# EasyEDA schematic TerraceLights.json
TITLE: Terrace Lights Boards Integrator; REV: 1.0; Date: 2019-01-25; Sheet: 1/1; Drawn By: ivan.aragones.muniesa; Company: Your Company
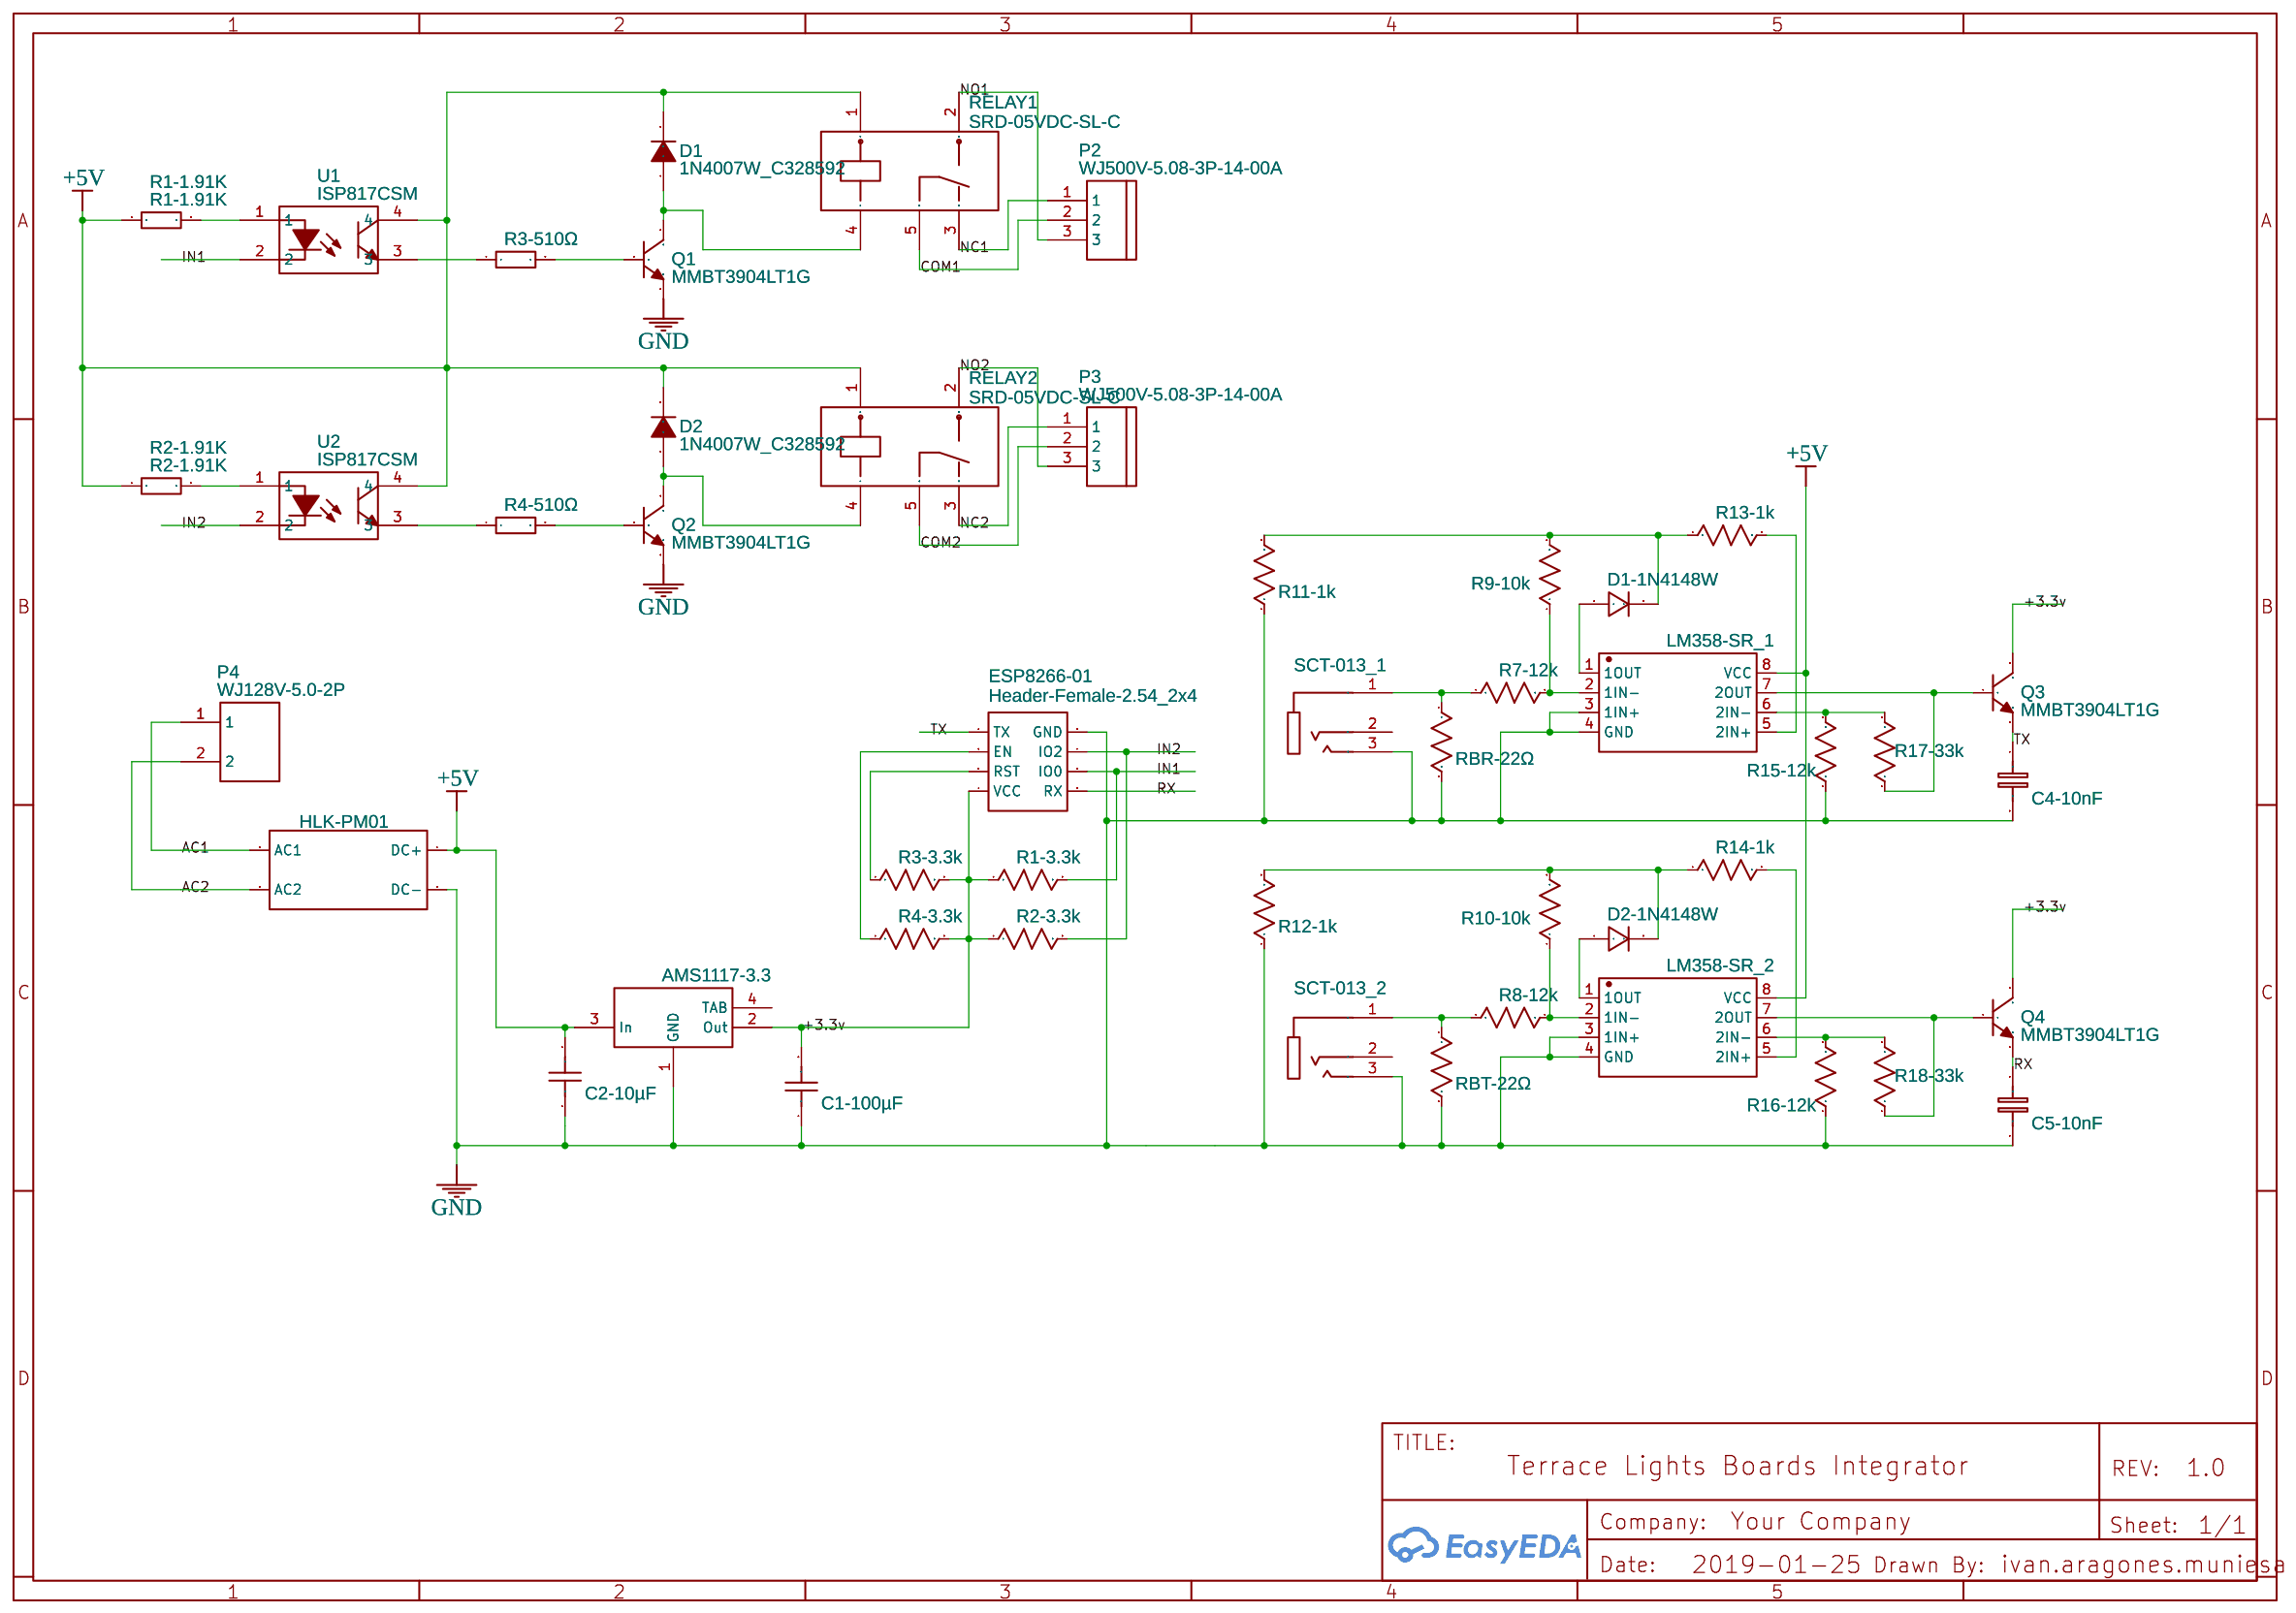
[diagram p0: schematic sheet]

## Parts
ASM1117-3  AMS1117-3.3  [SOT-223]  (section 3)
C1-100F  C1-100µF  [1206]
C2-10F  C2-10µF  [1206]
C4-10NF  C4-10nF  [1206]
C5-10NF  C5-10nF  [1206]
D1  1N4007W_C328592  [SOD-123FL]
D1-1N4148W  D1-1N4148W  [SOD-123]
D2  1N4007W_C328592  [SOD-123FL]
D2-1N4148W  D2-1N4148W  [SOD-123]
ESP8266-01  Header-Female-2.54_2x4  [DIP-2X4P-2.54]
HLK-PM01  HLK-PM01  [HLK-PM01]
LM358-SR_1  LM358-SR_1  [SOIC-8_150MIL]
LM358-SR_2  LM358-SR_2  [SOIC-8_150MIL]
P2  WJ500V-5.08-3P-14-00A  [WJ500V-5.08-3P]
P3  WJ500V-5.08-3P-14-00A  [WJ500V-5.08-3P]
P4  WJ128V-5.0-2P  [WJ128V-2P-5.0]
Q1  MMBT3904LT1G  [SOT-23(SOT-23-3)]
Q2  MMBT3904LT1G  [SOT-23(SOT-23-3)]
Q3  MMBT3904LT1G  [SOT-23(SOT-23-3)]
Q4  MMBT3904LT1G  [SOT-23(SOT-23-3)]
R1-1.91K  R1-1.91K  [0805]
R1-3.3K  R1-3.3k  [1206]
R2-1.91K  R2-1.91K  [0805]
R2-3.3K  R2-3.3k  [1206]
R3-3.3K  R3-3.3k  [1206]
R3-510  R3-510Ω  [0805]
R4-3.3K  R4-3.3k  [1206]
R4-510  R4-510Ω  [0805]
R7-12K  R7-12k  [1206]
R8-12K  R8-12k  [1206]
R9-10K  R9-10k  [1206]
R10-10K  R10-10k  [1206]
R11-1K  R11-1k  [1206]
R12-1K  R12-1k  [1206]
R13-1K  R13-1k  [1206]
R14-1K  R14-1k  [1206]
R15-12K  R15-12k  [1206]
R16-12K  R16-12k  [1206]
R17-33K  R17-33k  [1206]
R18-33K  R18-33k  [1206]
RBR-22  RBR-22Ω  [1206]
RBT-22  RBT-22Ω  [1206]
RELAY1  SRD-05VDC-SL-C  [RELAY-SL-SRD]
RELAY2  SRD-05VDC-SL-C  [RELAY-SL-SRD]
SCT-013_1  SCT-013_1  [PJ-320B]
SCT-013_2  SCT-013_2  [PJ-320B]
U1  ISP817CSM  [SMD-4]
U2  ISP817CSM  [SMD-4]

## Library data of the parts
ASM1117-3 = -: sourceId: dwIGgezVh; Supplier Part: C6186; Supplier: LCSC; Manufacturer: AMS; LCSC Assembly: Yes; image: https://assets.lcsc.com/images/szlcsc/900x900/C165482_front.jpg
C1-100F = Cap_1206_US: Manufacturer Part: JMK316ABJ107ML-T; Supplier: LCSC; Supplier Part: C268006; Manufacturer: Taiyo Yuden
C2-10F = Cap_1206_US: Manufacturer Part: JMK316BJ106KL-T; Supplier: LCSC; Supplier Part: C92789; Manufacturer: Taiyo Yuden
C4-10NF C5-10NF = Cap_RAD-0.1_EU: Manufacturer Part: 1206B103K101; Supplier: LCSC; Supplier Part: C77497; Manufacturer: WTC
D1 D2 = -: Supplier: LCSC; Supplier Part: C328592; Manufacturer: BLUE ROCKET; Manufacturer Part: 1N4007W; Contributor: LCSC
D1-1N4148W D2-1N4148W = -: Supplier Part: C81598; Supplier: LCSC; Manufacturer: SEMTECH; Manufacturer Part: 1N4148W; image: //image.lceda.cn/szlcsc/C81598.jpg
ESP8266-01 = -: Supplier Part: C124422; Supplier: LCSC; Manufacturer: Ckmtw; Manufacturer Part: 220S-2*4P H=8.5MM Ytype Gold-plated
HLK-PM01 = -: sourceId: u1BzxTRca; Manufacturer Part: ?; Mounted: No
LM358-SR_1 LM358-SR_2 = -: Supplier Part: C93149; Supplier: LCSC; Manufacturer: 3PEAK; Manufacturer Part: LM358-SR
P2 P3 = -: Supplier: LCSC; Manufacturer: ReliaPro; image: //image.lceda.cn/szlcsc/C72334.jpg; Supplier Part: C72334
P4 = -: Supplier: LCSC; Manufacturer: ReliaPro; Supplier Part: C8269
Q1-Q4 = -: Supplier: LCSC; Manufacturer: ON; Supplier Part: C81464
R1-1.91K R2-1.91K = ARG05FTC1911: Supplier: LCSC; Supplier Part: C218406; Manufacturer: Viking Tech; Contributor: LCSC
R1-3.3K R2-3.3K = Res_AXIAL-0.3(1/8W)_US: Manufacturer Part: TC0625B3301T5E; Supplier: LCSC; Manufacturer: Uniroyal Elec; Supplier Part: C95524
R3-3.3K R4-3.3K = Res_AXIAL-0.3(1/8W)_US: Manufacturer Part: TC0625B3301T5E; Supplier: LCSC; Supplier Part: C95524; Manufacturer: Uniroyal Elec
R3-510 R4-510 = PTFR0805B510RN9: Supplier: LCSC; Supplier Part: C328445; Manufacturer: ResistorToday; Contributor: LCSC
R7-12K R8-12K R15-12K R16-12K = Res_1206(1/4W)_US: Manufacturer Part: AR06DTDV1202; Supplier: LCSC; Supplier Part: C319895; Manufacturer: Viking Tech
R9-10K R10-10K = Res_1206(1/4W)_US: Manufacturer Part: B57621C5103K062; Supplier: LCSC; Supplier Part: C117697; Manufacturer: TDK
R11-1K R12-1K R13-1K R14-1K = Res_1206(1/4W)_US: Manufacturer Part: AR06BTDV1001; Supplier: LCSC; Supplier Part: C319818; Manufacturer: Viking Tech
R17-33K R18-33K = Res_1206(1/4W)_US: Manufacturer Part: ARG06DTC3302; Supplier: LCSC; Supplier Part: C311978; Manufacturer: Viking Tech
RBR-22 RBT-22 = Res_1206(1/4W)_US: Manufacturer Part: ARG06FTC0220; Supplier: LCSC; Supplier Part: C294137; Manufacturer: Viking Tech
RELAY1 RELAY2 = -: Supplier: LCSC; Manufacturer: SONGLE; image: //image.lceda.cn/szlcsc/C35449.jpg; Supplier Part: C35449
SCT-013_1 SCT-013_2 = -: Supplier: LCSC; Manufacturer: BOOMELE; Contributor: LCSC; Supplier Part: C18594
U1 U2 = -: Supplier: LCSC; Supplier Part: C84337; Manufacturer: Isocom Components; Contributor: LCSC

## Nets
+3.3v: ASM1117-3.2(Out) C1-100F.2 ESP8266-01.7(VCC) Q3.3 Q4.3 R1-3.3K.1 R2-3.3K.1 R3-3.3K.2 R4-3.3K.2
+5V: ASM1117-3.3(In) C2-10F.2 D1.2 D2.2 HLK-PM01.4(DC+) LM358-SR_1.8(VCC) LM358-SR_2.8(VCC) R1-1.91K.1 R2-1.91K.1 RELAY1.1 RELAY2.1 U1.4 U2.4
GND: ASM1117-3.1(GND) C1-100F.1 C2-10F.1 C4-10NF.2 C5-10NF.2 ESP8266-01.2(GND) HLK-PM01.3(DC-) LM358-SR_1.3(1IN+) LM358-SR_1.4(GND) LM358-SR_2.3(1IN+) LM358-SR_2.4(GND) Q1.2 Q2.2 R11-1K.1 R12-1K.1 R15-12K.1 R16-12K.1 RBR-22.2 RBT-22.2 SCT-013_1.3 SCT-013_2.3
AC1: HLK-PM01.1(AC1) P4.1
AC2: HLK-PM01.2(AC2) P4.2
COM1: P2.2 RELAY1.5
COM2: P3.2 RELAY2.5
IN1: ESP8266-01.6(IO0) R1-3.3K.2 U1.2
IN2: ESP8266-01.4(IO2) R2-3.3K.2 U2.2
NC1: P2.1 RELAY1.3
NC2: P3.1 RELAY2.3
NO1: P2.3 RELAY1.2
NO2: P3.3 RELAY2.2
RX: C5-10NF.1 ESP8266-01.8(RX) Q4.2
TX: C4-10NF.1 ESP8266-01.1(TX) Q3.2
Net-(D1-1): D1.1 Q1.3 RELAY1.4
Net-(D1-1N4148W-1): D1-1N4148W.1(A) LM358-SR_1.1(1OUT)
Net-(D1-1N4148W-2): D1-1N4148W.2(K) R9-10K.2 R11-1K.2 R13-1K.1
Net-(D2-1): D2.1 Q2.3 RELAY2.4
Net-(D2-1N4148W-1): D2-1N4148W.1(A) LM358-SR_2.1(1OUT)
Net-(D2-1N4148W-2): D2-1N4148W.2(K) R10-10K.2 R12-1K.2 R14-1K.1
Net-(ESP8266-01-3): ESP8266-01.3(EN) R4-3.3K.1
Net-(ESP8266-01-5): ESP8266-01.5(RST) R3-3.3K.1
Net-(LM358-SR_1-2): LM358-SR_1.2(1IN-) R7-12K.2 R9-10K.1
Net-(LM358-SR_1-5): LM358-SR_1.5(2IN+) R13-1K.2
Net-(LM358-SR_1-6): LM358-SR_1.6(2IN-) R15-12K.2 R17-33K.2
Net-(LM358-SR_1-7): LM358-SR_1.7(2OUT) Q3.1 R17-33K.1
Net-(LM358-SR_2-2): LM358-SR_2.2(1IN-) R8-12K.2 R10-10K.1
Net-(LM358-SR_2-5): LM358-SR_2.5(2IN+) R14-1K.2
Net-(LM358-SR_2-6): LM358-SR_2.6(2IN-) R16-12K.2 R18-33K.2
Net-(LM358-SR_2-7): LM358-SR_2.7(2OUT) Q4.1 R18-33K.1
Net-(Q1-1): Q1.1 R3-510.2
Net-(Q2-1): Q2.1 R4-510.2
Net-(R1-1.91K-2): R1-1.91K.2 U1.1
Net-(R2-1.91K-2): R2-1.91K.2 U2.1
Net-(R3-510-1): R3-510.1 U1.3
Net-(R4-510-1): R4-510.1 U2.3
Net-(R7-12K-1): R7-12K.1 RBR-22.1 SCT-013_1.1
Net-(R8-12K-1): R8-12K.1 RBT-22.1 SCT-013_2.1

Not connected (* = marked no-connect by the designer): ASM1117-3 4(TAB); SCT-013_1 2; SCT-013_2 2
